# Altium schematic sheet 2esp-erc-schematic.SchDoc
size A2; SheetNumber: 1; SheetTotal: 2
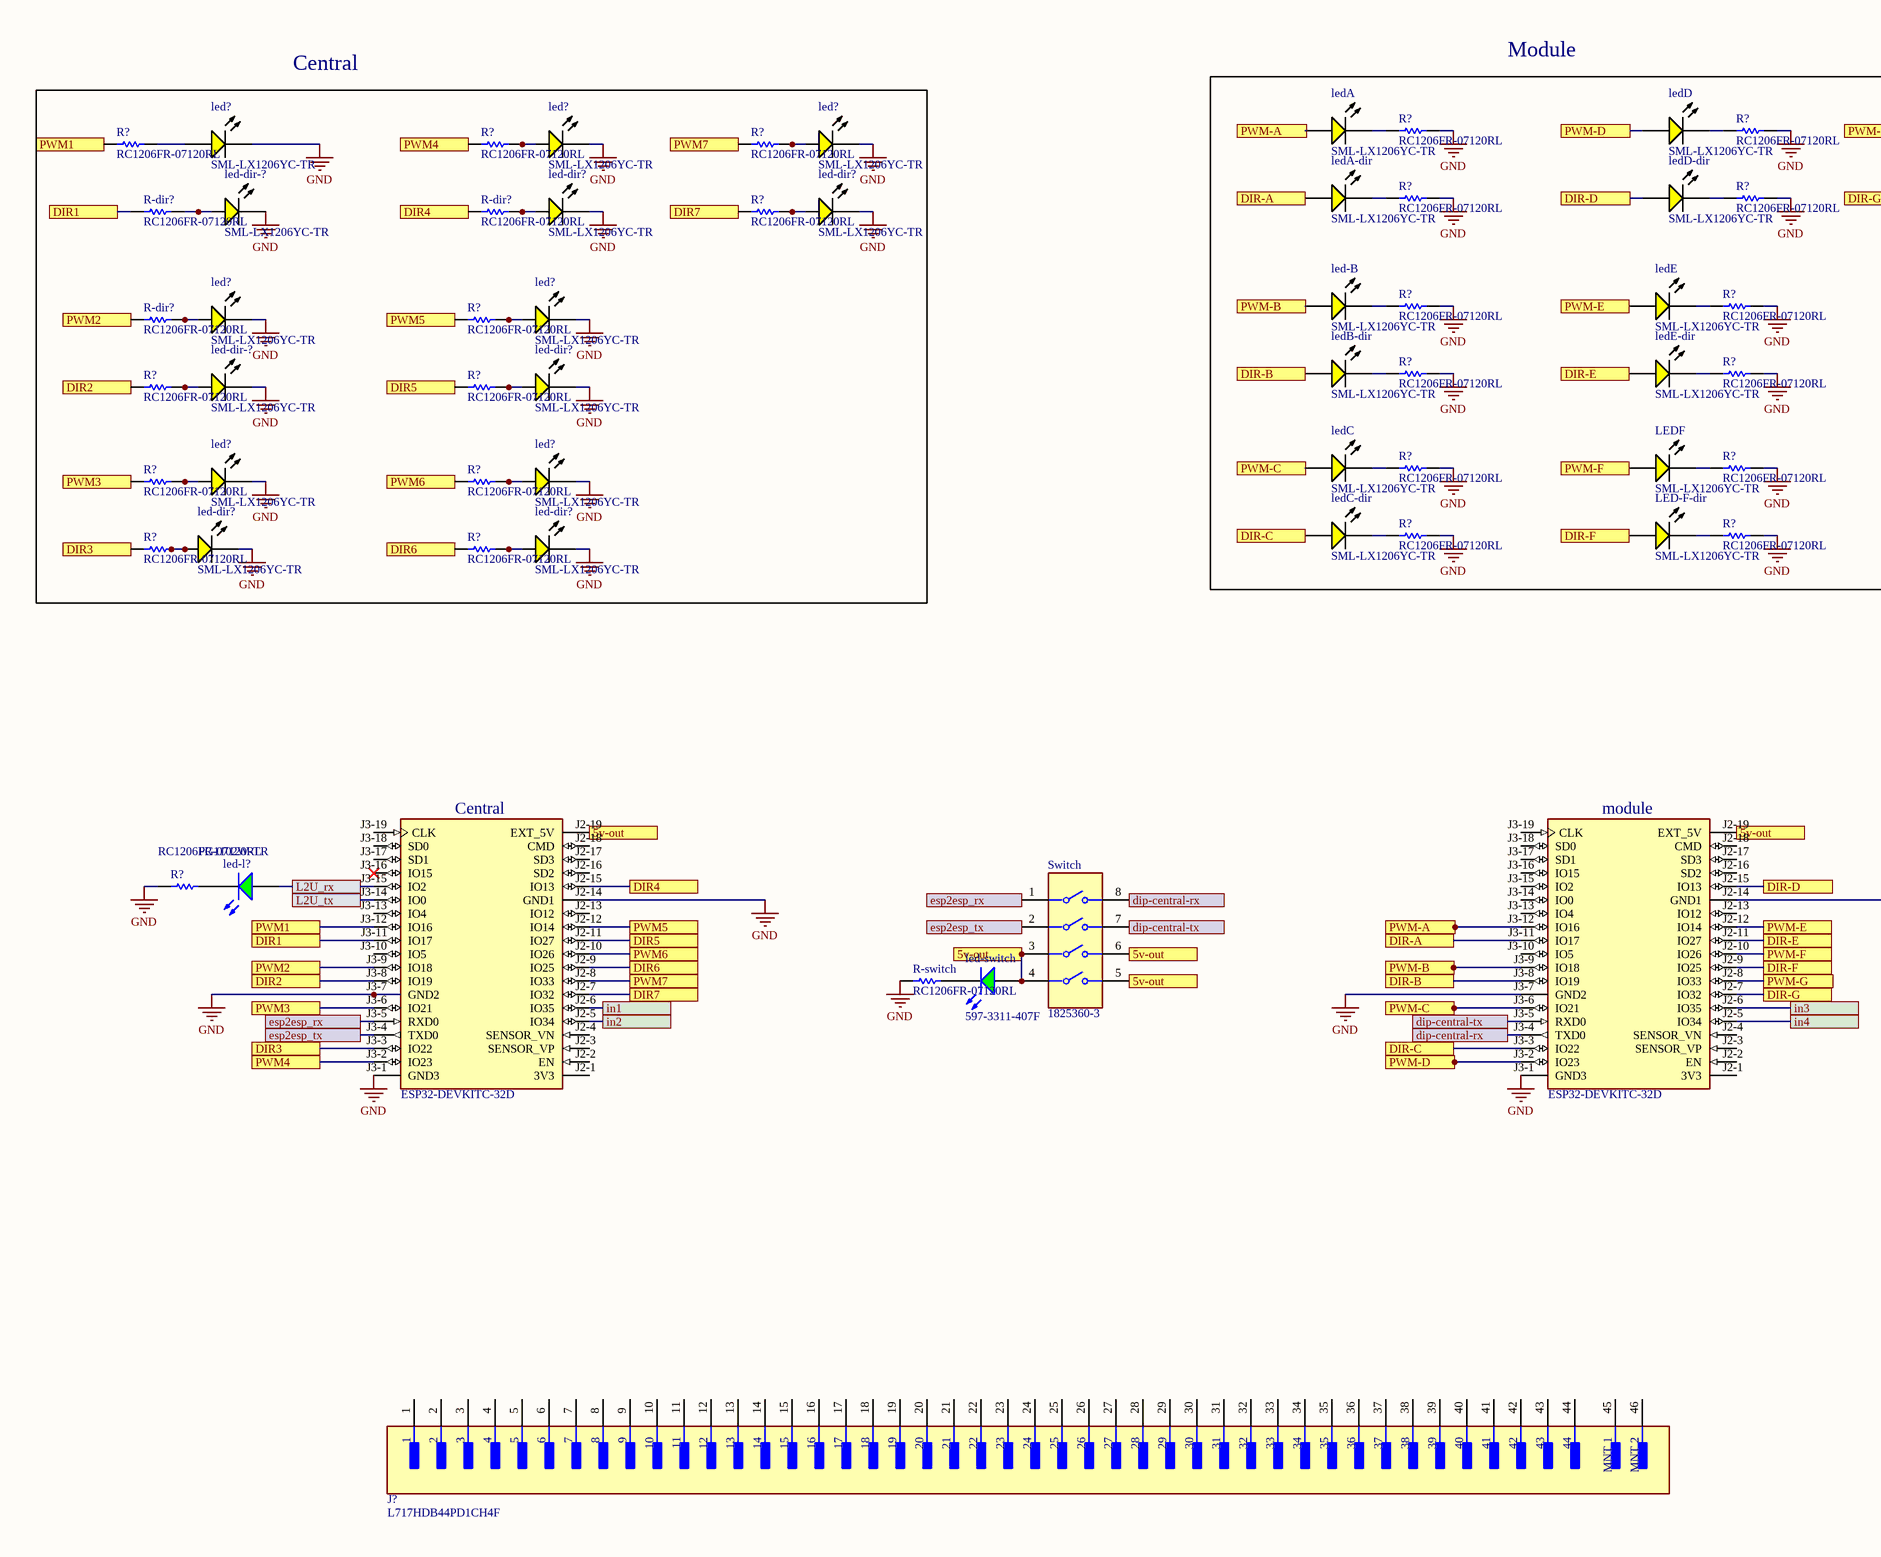
[diagram p0: 2esp-erc-schematic.SchDoc, left]
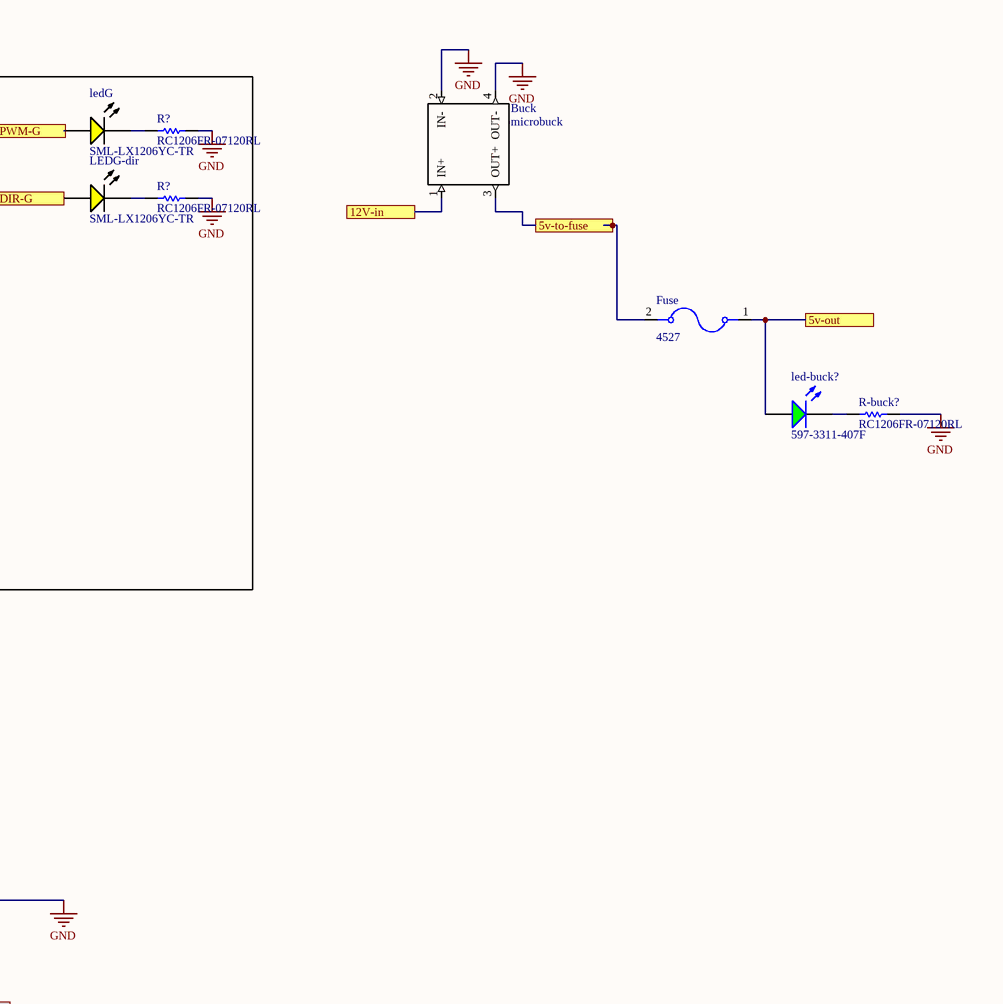
[diagram p1: 2esp-erc-schematic.SchDoc, right]

## Parts
(Parts that share a designator on the sheet are numbered #1, #2 ... from top to bottom, then left to right.)
Buck  microbuck  [Micro buck]
Central  ESP32-DEVKITC-32D  [MODULE_ESP32-DEVKITC-32D]
Fuse  4527  [FUSE_4527]
J?  L717HDB44PD1CH4F  [FP-L717HDB44PD1CH4F-MFG]
led-B  SML-LX1206YC-TR  [LUMX-SML-LX1206YC-TR_V]
led-buck?  597-3311-407F  [DIAL-597-3311-407F_V]
led-dir-?#1  SML-LX1206YC-TR  [LUMX-SML-LX1206YC-TR_V]
led-dir-?#2  SML-LX1206YC-TR  [LUMX-SML-LX1206YC-TR_V]
led-dir?#1  SML-LX1206YC-TR  [LUMX-SML-LX1206YC-TR_V]
led-dir?#2  SML-LX1206YC-TR  [LUMX-SML-LX1206YC-TR_V]
led-dir?#3  SML-LX1206YC-TR  [LUMX-SML-LX1206YC-TR_V]
led-dir?#4  SML-LX1206YC-TR  [LUMX-SML-LX1206YC-TR_V]
led-dir?#5  SML-LX1206YC-TR  [LUMX-SML-LX1206YC-TR_V]
LED-F-dir  SML-LX1206YC-TR  [LUMX-SML-LX1206YC-TR_V]
led-l?  PG1102W-TR  [STEC-1102W_V]
led-switch  597-3311-407F  [DIAL-597-3311-407F_V]
led?#1  SML-LX1206YC-TR  [LUMX-SML-LX1206YC-TR_V]
led?#2  SML-LX1206YC-TR  [LUMX-SML-LX1206YC-TR_V]
led?#3  SML-LX1206YC-TR  [LUMX-SML-LX1206YC-TR_V]
led?#4  SML-LX1206YC-TR  [LUMX-SML-LX1206YC-TR_V]
led?#5  SML-LX1206YC-TR  [LUMX-SML-LX1206YC-TR_V]
led?#6  SML-LX1206YC-TR  [LUMX-SML-LX1206YC-TR_V]
led?#7  SML-LX1206YC-TR  [LUMX-SML-LX1206YC-TR_V]
ledA  SML-LX1206YC-TR  [LUMX-SML-LX1206YC-TR_V]
ledA-dir  SML-LX1206YC-TR  [LUMX-SML-LX1206YC-TR_V]
ledB-dir  SML-LX1206YC-TR  [LUMX-SML-LX1206YC-TR_V]
ledC  SML-LX1206YC-TR  [LUMX-SML-LX1206YC-TR_V]
ledC-dir  SML-LX1206YC-TR  [LUMX-SML-LX1206YC-TR_V]
ledD  SML-LX1206YC-TR  [LUMX-SML-LX1206YC-TR_V]
ledD-dir  SML-LX1206YC-TR  [LUMX-SML-LX1206YC-TR_V]
ledE  SML-LX1206YC-TR  [LUMX-SML-LX1206YC-TR_V]
ledE-dir  SML-LX1206YC-TR  [LUMX-SML-LX1206YC-TR_V]
LEDF  SML-LX1206YC-TR  [LUMX-SML-LX1206YC-TR_V]
ledG  SML-LX1206YC-TR  [LUMX-SML-LX1206YC-TR_V]
LEDG-dir  SML-LX1206YC-TR  [LUMX-SML-LX1206YC-TR_V]
module  ESP32-DEVKITC-32D  [MODULE_ESP32-DEVKITC-32D]
R-buck?  RC1206FR-07120RL  [RESC3116X65X40LL10T20]
R-dir?#1  RC1206FR-07120RL  [RESC3116X65X40LL10T20]
R-dir?#2  RC1206FR-07120RL  [RESC3116X65X40LL10T20]
R-dir?#3  RC1206FR-07120RL  [RESC3116X65X40LL10T20]
R-switch  RC1206FR-07120RL  [RESC3116X65X40LL10T20]
R?#1  RC1206FR-07120RL  [RESC3116X65X40LL10T20]
R?#2  RC1206FR-07120RL  [RESC3116X65X40LL10T20]
R?#3  RC1206FR-07120RL  [RESC3116X65X40LL10T20]
R?#4  RC1206FR-07120RL  [RESC3116X65X40LL10T20]
R?#5  RC1206FR-07120RL  [RESC3116X65X40LL10T20]
R?#6  RC1206FR-07120RL  [RESC3116X65X40LL10T20]
R?#7  RC1206FR-07120RL  [RESC3116X65X40LL10T20]
R?#8  RC1206FR-07120RL  [RESC3116X65X40LL10T20]
R?#9  RC1206FR-07120RL  [RESC3116X65X40LL10T20]
R?#10  RC1206FR-07120RL  [RESC3116X65X40LL10T20]
R?#11  RC1206FR-07120RL  [RESC3116X65X40LL10T20]
R?#12  RC1206FR-07120RL  [RESC3116X65X40LL10T20]
R?#13  RC1206FR-07120RL  [RESC3116X65X40LL10T20]
R?#14  RC1206FR-07120RL  [RESC3116X65X40LL10T20]
R?#15  RC1206FR-07120RL  [RESC3116X65X40LL10T20]
R?#16  RC1206FR-07120RL  [RESC3116X65X40LL10T20]
R?#17  RC1206FR-07120RL  [RESC3116X65X40LL10T20]
R?#18  RC1206FR-07120RL  [RESC3116X65X40LL10T20]
R?#19  RC1206FR-07120RL  [RESC3116X65X40LL10T20]
R?#20  RC1206FR-07120RL  [RESC3116X65X40LL10T20]
R?#21  RC1206FR-07120RL  [RESC3116X65X40LL10T20]
R?#22  RC1206FR-07120RL  [RESC3116X65X40LL10T20]
R?#23  RC1206FR-07120RL  [RESC3116X65X40LL10T20]
R?#24  RC1206FR-07120RL  [RESC3116X65X40LL10T20]
R?#25  RC1206FR-07120RL  [RESC3116X65X40LL10T20]
R?#26  RC1206FR-07120RL  [RESC3116X65X40LL10T20]
Switch  1825360-3  [FP-1825360-3-MFG]

## Blocks framed on the sheet
Module: led-B LED-F-dir ledA ledA-dir ledB-dir ledC ledC-dir ledD ledD-dir ledE ledE-dir LEDF ledG LEDG-dir R?#1-R?#3 R?#7-R?#9 R?#11 R?#12 R?#14 R?#15 R?#18 R?#19 R?#22 R?#23
Central: led-dir-?#1 led-dir-?#2 led-dir?#1-led-dir?#5 led?#1-led?#7 R-dir?#1-R-dir?#3 R?#4-R?#6 R?#10 R?#13 R?#16 R?#17 R?#20 R?#21 R?#24 R?#25

## Ports
5v-out, 5v-to-fuse, 12V-in, dip-central-rx, dip-central-tx, DIR1, DIR2, DIR3, DIR4, DIR5, DIR6, DIR7, DIR-A, DIR-B, DIR-C, DIR-D, DIR-E, DIR-F, DIR-G, esp2esp_rx, esp2esp_tx, in1, in2, in3, in4, L2U_rx, L2U_tx, PWM1, PWM2, PWM3, PWM4, PWM5, PWM6, PWM7, PWM-A, PWM-B, PWM-C, PWM-D, PWM-E, PWM-F, PWM-G

## Nets
GND: Buck.2(IN-) Buck.4(OUT-) Central.J2-14(GND1) Central.J3-1(GND3) Central.J3-7(GND2) led-dir-?#1.2(K) led-dir-?#2.2(K) led-dir?#1.2(K) led-dir?#2.2(K) led-dir?#3.2(K) led-dir?#4.2(K) led-dir?#5.2(K) led?#1.2(K) led?#2.2(K) led?#3.2(K) led?#4.2(K) led?#5.2(K) led?#6.2(K) led?#7.2(K) module.J2-14(GND1) module.J3-1(GND3) module.J3-7(GND2) R-buck?.2 R-switch.1 R?#1.2 R?#2.2 R?#3.2 R?#7.2 R?#8.2 R?#9.2 R?#11.2 R?#12.2 R?#14.2 R?#15.2 R?#18.2 R?#19.2 R?#22.2 R?#23.2 R?#26.1
5v-out: Central.J2-19(EXT_5V) Fuse.1 led-buck?.1(A) led-switch.1(A) module.J2-19(EXT_5V) Switch.3 Switch.4 Switch.5 Switch.6 ; port 5v-out
5v-to-fuse: Buck.3(OUT+) Fuse.2 ; port 5v-to-fuse
12V-in: Buck.1(IN+) ; port 12V-in
dip-central-rx: module.J3-4(TXD0) Switch.8 ; port dip-central-rx
dip-central-tx: module.J3-5(RXD0) Switch.7 ; port dip-central-tx
DIR1: Central.J3-11(IO17) R-dir?#1.1 ; port DIR1
DIR2: Central.J3-8(IO19) R?#16.1 ; port DIR2
DIR3: Central.J3-3(IO22) R?#24.1 ; port DIR3
DIR4: Central.J2-15(IO13) R-dir?#2.1 ; port DIR4
DIR5: Central.J2-11(IO27) R?#17.1 ; port DIR5
DIR6: Central.J2-9(IO25) R?#25.1 ; port DIR6
DIR7: Central.J2-7(IO32) R?#10.1 ; port DIR7
DIR-A: ledA-dir.1(A) module.J3-11(IO17) ; port DIR-A
DIR-B: ledB-dir.1(A) module.J3-8(IO19) ; port DIR-B
DIR-C: ledC-dir.1(A) module.J3-3(IO22) ; port DIR-C
DIR-D: ledD-dir.1(A) module.J2-15(IO13) ; port DIR-D
DIR-E: ledE-dir.1(A) module.J2-11(IO27) ; port DIR-E
DIR-F: LED-F-dir.1(A) module.J2-9(IO25) ; port DIR-F
DIR-G: LEDG-dir.1(A) module.J2-7(IO32) ; port DIR-G
esp2esp_rx: Central.J3-5(RXD0) Switch.1 ; port esp2esp_rx
esp2esp_tx: Central.J3-4(TXD0) Switch.2 ; port esp2esp_tx
in1: Central.J2-6(IO35) ; port in1
in2: Central.J2-5(IO34) ; port in2
in3: module.J2-6(IO35) ; port in3
in4: module.J2-5(IO34) ; port in4
L2U_rx: Central.J3-15(IO2) led-l?.1(A) ; port L2U_rx
L2U_tx: Central.J3-14(IO0) ; port L2U_tx
PWM1: Central.J3-12(IO16) R?#4.1 ; port PWM1
PWM2: Central.J3-9(IO18) R-dir?#3.1 ; port PWM2
PWM3: Central.J3-6(IO21) R?#20.1 ; port PWM3
PWM4: Central.J3-2(IO23) R?#5.1 ; port PWM4
PWM5: Central.J2-12(IO14) R?#13.1 ; port PWM5
PWM6: Central.J2-10(IO26) R?#21.1 ; port PWM6
PWM7: Central.J2-8(IO33) R?#6.1 ; port PWM7
PWM-A: ledA.1(A) module.J3-12(IO16) ; port PWM-A
PWM-B: led-B.1(A) module.J3-9(IO18) ; port PWM-B
PWM-C: ledC.1(A) module.J3-6(IO21) ; port PWM-C
PWM-D: ledD.1(A) module.J3-2(IO23) ; port PWM-D
PWM-E: ledE.1(A) module.J2-12(IO14) ; port PWM-E
PWM-F: LEDF.1(A) module.J2-10(IO26) ; port PWM-F
PWM-G: ledG.1(A) module.J2-8(IO33) ; port PWM-G
Netled-B_2: led-B.2(K) R?#11.1
Netled-buck?_2: led-buck?.2(K) R-buck?.1
Netled-dir-?#1_1: led-dir-?#1.1(A) R-dir?#1.2
Netled-dir-?#2_1: led-dir-?#2.1(A) R?#16.2
Netled-dir?#1_1: led-dir?#1.1(A) R-dir?#2.2
Netled-dir?#2_1: led-dir?#2.1(A) R?#10.2
Netled-dir?#3_1: led-dir?#3.1(A) R?#17.2
Netled-dir?#4_1: led-dir?#4.1(A) R?#24.2
Netled-dir?#5_1: led-dir?#5.1(A) R?#25.2
NetLED-F-dir_2: LED-F-dir.2(K) R?#23.1
Netled-l?_2: led-l?.2(K) R?#26.2
Netled-switch_2: led-switch.2(K) R-switch.2
Netled?#1_1: led?#1.1(A) R?#4.2
Netled?#2_1: led?#2.1(A) R?#5.2
Netled?#3_1: led?#3.1(A) R?#6.2
Netled?#4_1: led?#4.1(A) R-dir?#3.2
Netled?#5_1: led?#5.1(A) R?#13.2
Netled?#6_1: led?#6.1(A) R?#20.2
Netled?#7_1: led?#7.1(A) R?#21.2
NetledA-dir_2: ledA-dir.2(K) R?#7.1
NetledA_2: ledA.2(K) R?#1.1
NetledB-dir_2: ledB-dir.2(K) R?#14.1
NetledC-dir_2: ledC-dir.2(K) R?#22.1
NetledC_2: ledC.2(K) R?#18.1
NetledD-dir_2: ledD-dir.2(K) R?#8.1
NetledD_2: ledD.2(K) R?#2.1
NetledE-dir_2: ledE-dir.2(K) R?#15.1
NetledE_2: ledE.2(K) R?#12.1
NetLEDF_2: LEDF.2(K) R?#19.1
NetLEDG-dir_2: LEDG-dir.2(K) R?#9.1
NetledG_2: ledG.2(K) R?#3.1

Not connected (* = marked no-connect by the designer): Central J2-1(3V3) J2-2(EN) J2-3(SENSOR_VP) J2-4(SENSOR_VN) J2-13(IO12) J2-16(SD2) J2-17(SD3) J2-18(CMD) J3-10(IO5) J3-13(IO4) J3-16(IO15)* J3-17(SD1) J3-18(SD0) J3-19(CLK); J? 1 2 3 4 5 6 7 8 9 10 11 12 13 14 15 16 17 18 19 20 21 22 23 24 25 26 27 28 29 30 31 32 33 34 35 36 37 38 39 40 41 42 43 44 45(MNT_1) 46(MNT_2); module J2-1(3V3) J2-2(EN) J2-3(SENSOR_VP) J2-4(SENSOR_VN) J2-13(IO12) J2-16(SD2) J2-17(SD3) J2-18(CMD) J3-10(IO5) J3-13(IO4) J3-14(IO0) J3-15(IO2) J3-16(IO15) J3-17(SD1) J3-18(SD0) J3-19(CLK)

## Library data of the parts
Central module = ESP32-DEVKITC-32D: WiFi Development Tools (802.11) ESP32 General Development Kit, ESP32-WROOM-32D on the board; MF: Espressif Systems; SnapEDA_Link: https://www.snapeda.com/parts/ESP32-DEVKITC-32D/Espressif+Systems/view-part/?ref=snap; Package: None; Value: *; MP: ESP32-DEVKITC-32D; Check_prices: https://www.snapeda.com/parts/ESP32-DEVKITC-32D/Espressif+Systems/view-part/?ref=eda
Fuse = 4527: Fuseholder; 5 A; 250 V; Nylon; Base only; Brass, Tin Plate (Contact); Value: *; MP: 4527; Package: None; Availability: Unavailable; Price: None
J? = CMP-02362-000001-1: CONN DSUB HD PLUG 44POS R/A SLDR; Current Rating: 3A; Body Material: Steel; Number of Contacts: 44; Connector Type: D-Sub; Number of Ports: 1; Gender: Male; Voltage Rating: 250V; Width: 12.55mm; Contact Plating: Gold; Max Operating Temperature: 105°C; Number of Terminals: 44; Length: 53.09mm; Number of Rows: 3; Number of Positions: 44; Min Operating Temperature: -55°C; Orientation: Right Angle; Packaging: Tray; Package Quantity: 50; Termination: Solder; Depth: 22.22mm; Housing Material: Thermoplastic; Mount: Through Hole; Contact Material: Brass
led-B led-dir-?#1 led-dir-?#2 led-dir?#1-led-dir?#5 LED-F-dir led?#1-led?#7 ledA ledA-dir ledB-dir ledC ledC-dir ledD ledD-dir ledE ledE-dir LEDF ledG LEDG-dir = CMP-2000-07124-1: Yellow LED, Water Clear Len, 585 nm, 2.1 V, -40 to 85 degC, 2-Pin SMD, RoHS, Tape and Reel; Manufacturer: Lumex; Product Training Modules: LEDsBenefitsofCustomLEDandLCDTechnology; Millicandela Rating: 6mcd; Catalog Drawings: SML-LX1206SeriesTopSML-LX1206SeriesSideSML-LX1206SeriesBottomSML-LX1206SeriesFootprint; Wavelength - Peak: 585nm; Other Names: 67-1358-2LU60357TRSMLLX1206YCTR; Lens Style/Size: RectanglewithFlatTop; Current - Test: 20mA; Lens Color: Colorless; Viewing Angle: 160°; Voltage - Forward (Vf) (Typ): 2.1V; Online Catalog: SML-LX1206RectanglewithFlatTop1206PackageLEDs; Mounting Type: SurfaceMount; Package Description: 2-Pin Surface Mount Device, Body 3.2 x 1.5 mm; Datasheet Version: Rev. K, 08/2012; Features: -; Color: Yellow; RoHS Information: RoHSCertofCompliance; Package Reference: SML-LX1206YC-TR; Supplier Device Package: 1206; Standard Package: 3,000; Series: -; Wavelength - Dominant: -; Package / Case: 1206(3216Metric); Mounting Technology: SurfaceMount; Height (Max): 1.10mm; Lens Transparency: Clear; Datasheet URL: http://www.lumex.com/content/files/ProductAttachment/SML-LX1206YC-TR.pdf; Family: LEDIndication-Discrete; Manufacturer URL: http://www.lumexinstruments.com/; Packaging: Tape&Reel(TR); Category: Optoelectronics; Size / Dimension: 3.20mmLx1.60mmW
led-buck? led-switch = CMP-2000-05651-1: LED Green, 75 mW, 30 mA, -30 to 85 degC, 2-Pin SMD, RoHS, Tape and Reel; Manufacturer: Dialight; Product Depth (mm): 1.5mm; Viewing Angle: 70deg; DELETED: Compliant; Number of  Elements: 1; Emitting Color: YellowGreen; Shape Type: Rectangular; Product Length (mm): 3mm; Forward Current: 30mA; Main Category: ChipLED; Luminous Intensity: 7.5mcd; High Brightness: No; Test Current (It): 20mA; Lens Type: NonDiffused; Reverse Voltage: 4V; Peak Wavelength: 560nm; Power Dissipation: 75W; Forward Voltage: 2.5V; Chip Material: GaP; Mounting: SurfaceMount; Product Height (mm): 1.5mm; Pin Count: 2; Type: Uni-Color; Datasheet URL: https://datasheet.ciiva.com/15117/getdatasheetpartid-142484-15117764.pdf; Mounting Technology: SurfaceMount; Rad Hardened: No; Operating Temperature Classification: Commercial; Lens Dimensions: 2x1.5x0.9mm; Operating Temp Range: -30Cto85C; Package Reference: 597-3311-407F; Package Type: SMD; Datasheet Version: 07/2002; Lum Intensity: 7.5mcd; Packaging: TapeandReel; Package Description: 2-Pin Surface Mount Device, Body 1.5 x 3 mm; Manufacturer URL: http://www.dialight.com/
led-l? = CMP-2000-06890-1: Green LED, 567 nm, 2.1 V, 30 mA, -30 to 85 degC, 2-Pin SMD, RoHS, Tape and Reel; Manufacturer: Stanley Electric; Viewing Angle: 69/85deg; High Brightness: No; Number of  Elements: 1; Peak Wavelength: 560nm; Forward Current: 30mA; Test Current (It): 20mA; Main Category: ChipLED; Dominant Wave Length: 567nm; Power Dissipation: 75W; Lum Intensity: 12mcd; Shape Type: Rectangular; Chip Material: GaP; Reverse Voltage: 4V; Product Depth (mm): 1.5mm; Forward Voltage: 2.5V; Product Length (mm): 3mm; DELETED: Compliant; Emitting Color: YellowGreen; Operating Temp Range: -30Cto85C; Datasheet URL: http://media.digikey.com/pdf/Data%20Sheets/Stanley%20Electric%20PDFs/1102W_Series.pdf; Packaging: TapeandReel; Package Reference: 1102W; Manufacturer URL: http://www.stanley-electric.com/; Package Description: 2-Pin Surface Mounted Device , Body 3 x 1.5 mm; Type: Uni-Color; Rad Hardened: No; Mounting Technology: SurfaceMount; Package Type: SMD; Operating Temperature Classification: Commercial; Product Height (mm): 1.5mm; Pin Count: 2; Lens Dimensions: 2x1.5x0.9mm; Datasheet Version: 08/2007; Mounting: SurfaceMount; Luminous Intensity: 12mcd
R-buck? R-dir?#1-R-dir?#3 R-switch R?#1-R?#26 = CMP-2000-06965-1: Chip Resistor, 120 Ohm, +/- 1%, 250 mW, -55 to 155 degC, 1206 (3216 Metric), RoHS, Tape and Reel; Manufacturer: Yageo; Resistor Element Type: ThickFilm; Resistance: 120ohm; Voltage Rating: 200V; Temperature Coefficient: ±100ppm/°C; Power Rating: 250mW; Product Range: RCSeries; SVHC: ToBeAdvised; Resistor Case Style: 1206[3216Metric]; Package Reference: 1206; Resistance Tolerance: ±1%; Package Description: 2-Pin Surface Mount Device, Body 3.1 x 1.6 mm; Manufacturer URL: http://www.yageo.com/; MSL: MSL1-Unlimited; Packaging: CutTape; Datasheet URL: http://www.yageo.com/documents/recent/PYu-RC_Group_51_RoHS_L_7.pdf; Mounting Technology: SurfaceMount; Datasheet Version: Rev. 7, 05/2017
Switch = CMP-03400-000022-1: SWITCH SLIDE DIP SPST 100MA 24V; Washable: Yes; Contact Current Rating: 1A; Electrical Life: 1000Cycles; Number of Circuits: 4; Pitch: 0.1inch; Actuator Length: 0.99mm; Contact Resistance: 50mR; Actuator Type: Standard; Contact Post Length: 4mm; Voltage Rating (DC): 5V; Actuator Material: Polybutylene; Sealable: No (Without); Max Voltage Rating (DC): 24V; Throw Configuration: SPST; Mount: Through Hole; Type: Switch; RoHS Compliant: Yes; Min Operating Temperature: -30°C; Max Operating Temperature: 85°C; Orientation: Straight; Packaging: Rail/Tube; Series: ADE; Lead Free: Lead Free; Depth: 7.49mm; Flammability Rating: UL94 V-0; Radiation Hardening: No; Terminal Pitch: 2.54mm; Package Quantity: 35; Contact Material: Copper Alloy; Housing Color: Black; Number of Positions: 4; Length: 0.476inch; ELV: Compliant; Termination: PC Pins; Housing Material: Polyphenylene; Contact Plating: Gold; Max Current Rating: 100mA; Height: 0.138inch